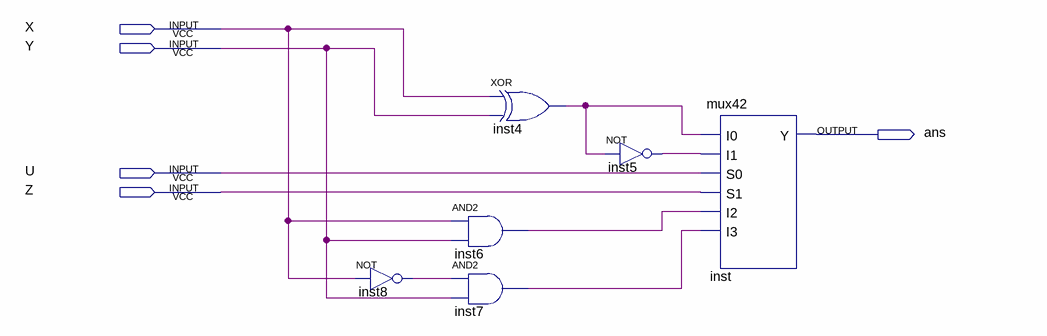
[diagram p0: schematic sheet]
// Quartus schematic use_mux42_to_4bit.bdf as structural Verilog: 6 symbols, 5 pins
module use_mux42_to_4bit (
  input  X,
  input  Y,
  input  U,
  input  Z,
  output ans
);

  wire inst4_out, inst5_out, inst6_out, inst7_out, inst8_out;

  not inst8 (inst8_out, X);
  xor inst4 (inst4_out, X, Y);
  and inst6 (inst6_out, X, Y);
  and inst7 (inst7_out, inst8_out, Y);
  not inst5 (inst5_out, inst4_out);
  mux42 inst (.I0(inst4_out), .I1(inst5_out), .S0(U), .S1(Z), .I2(inst6_out), .I3(inst7_out), .Y(ans));
endmodule
